# Altium schematic sheet Potencia.SchDoc: GRUPO ALTECH
size A3; DocumentNumber: GA0070; SheetNumber: 4; SheetTotal: 4
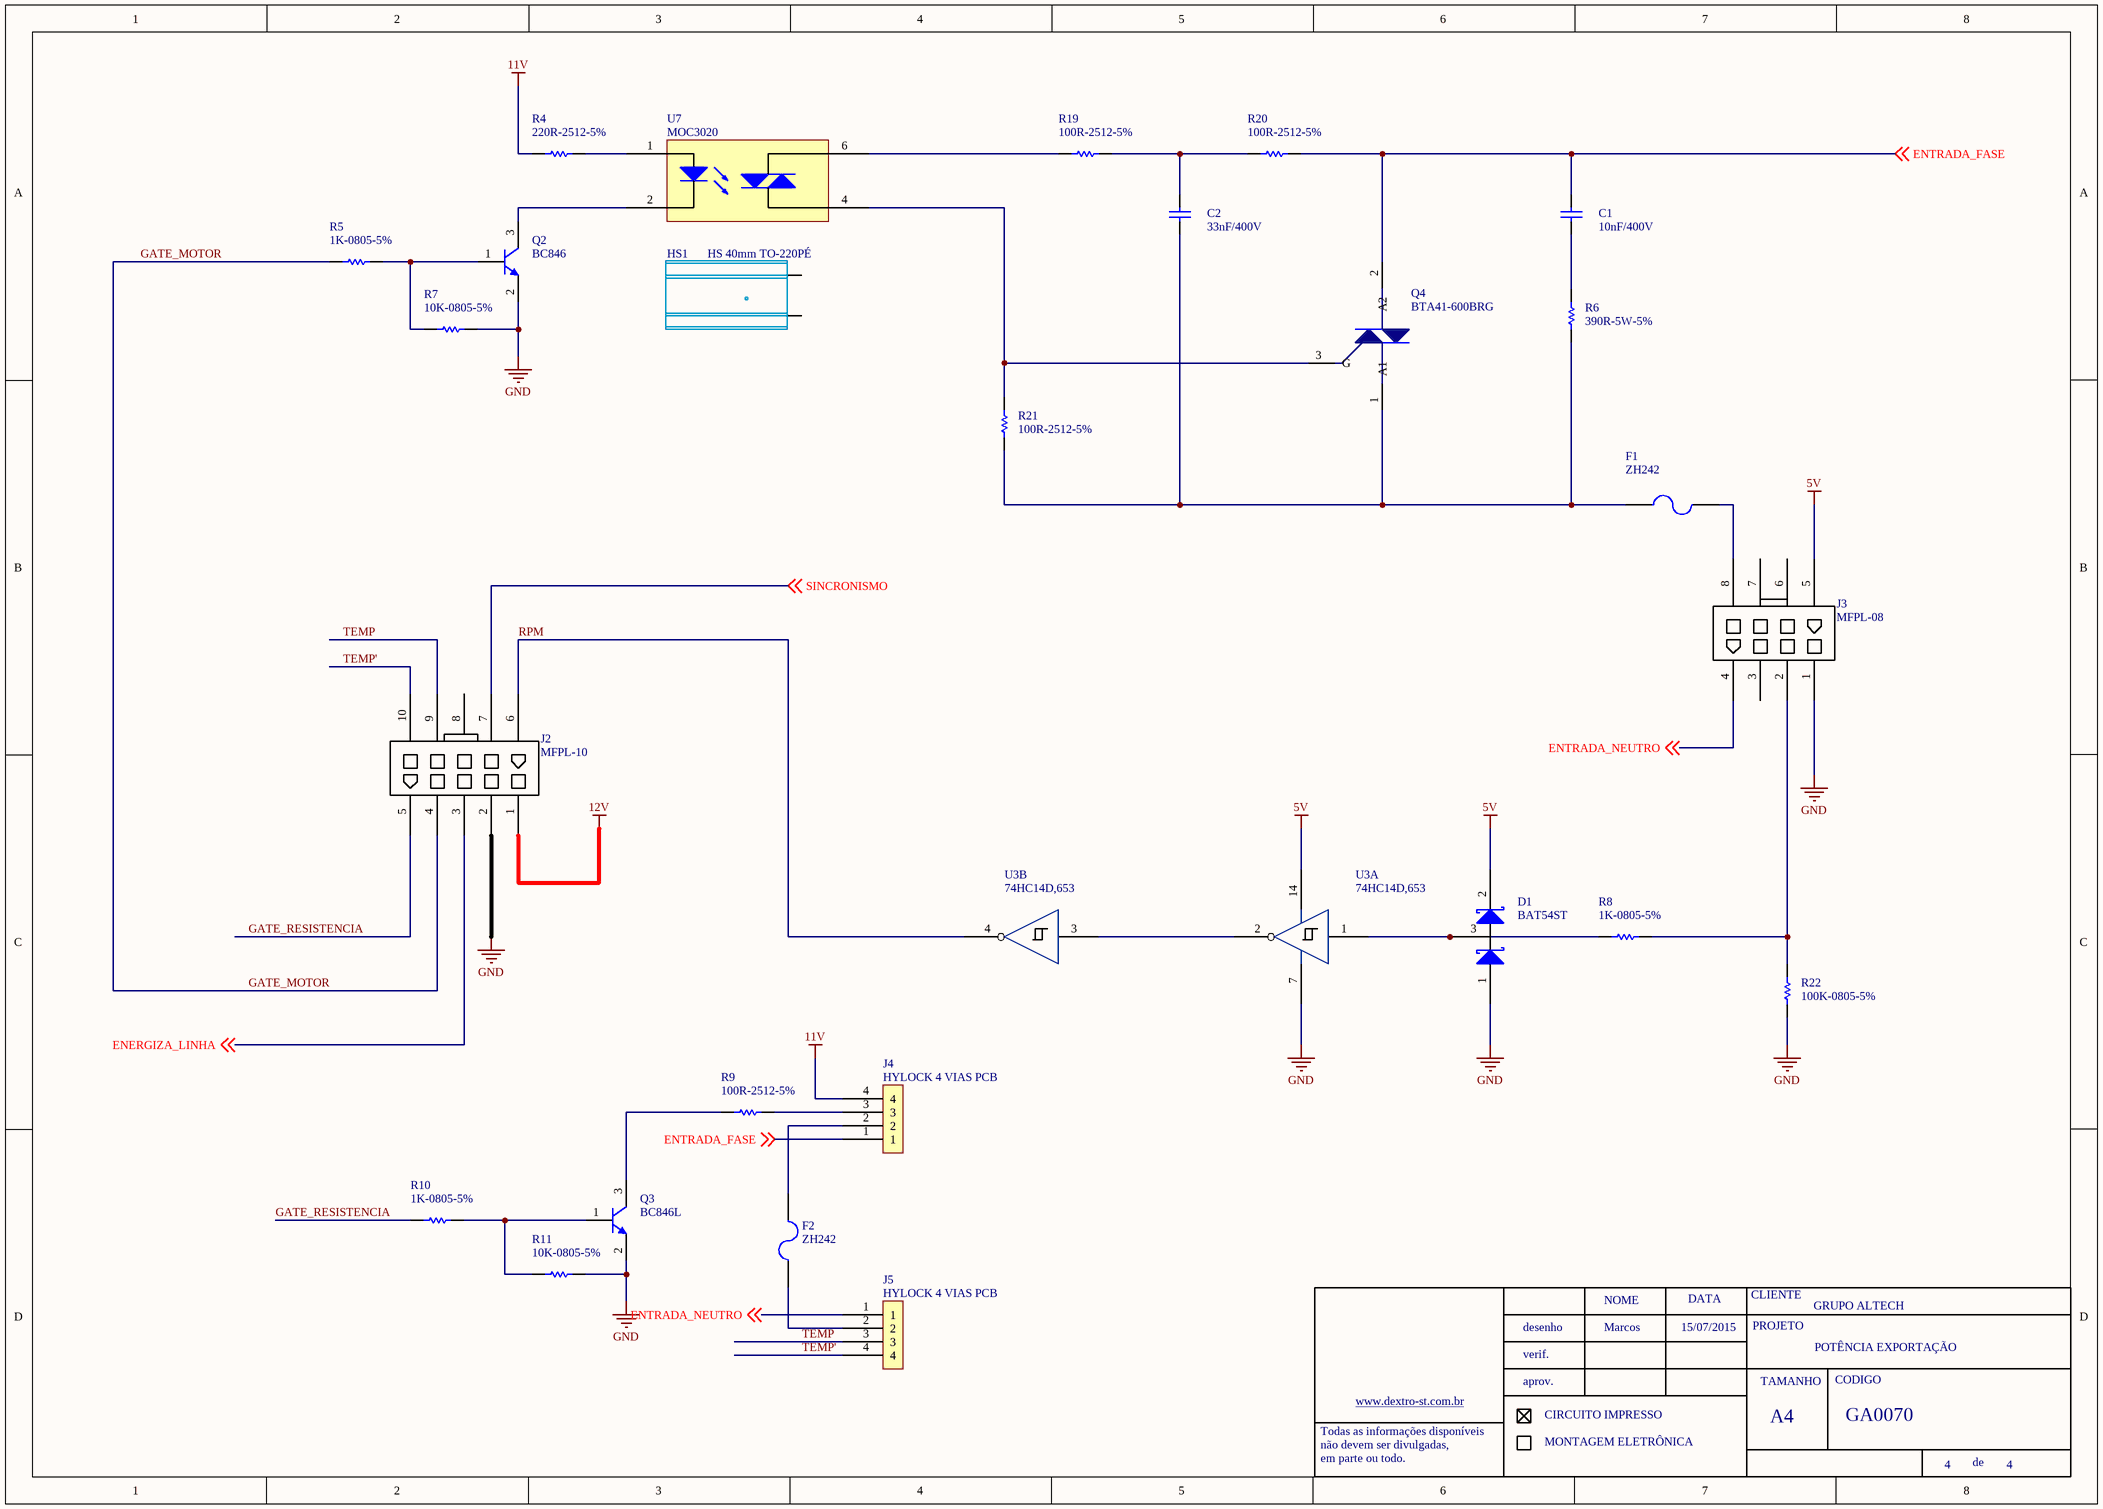
[diagram p0: Potencia.SchDoc]

## Parts
C1  10nF/400V  [cap 330nF/250V]
C2  33nF/400V  [cap 330nF/250V]
D1  BAT54ST  [SOT23 - REVISADO ONDA]
F1  ZH242  [ZH242_REVISADO]
F2  ZH242  [ZH242_REVISADO]
HS1  HS 40mm TO-220PÉ  [dissipador grande]
J2  MFPL-10  [MFPC-10]
J3  MFPL-08  [MFPC-08]
J4  HYLOCK 4 VIAS PCB  [CONECTOR HYLOK 4 VIAS]
J5  HYLOCK 4 VIAS PCB  [CONECTOR HYLOK 4 VIAS]
Q2  BC846  [SOT23 - REVISADO ONDA]
Q3  BC846L
Q4  BTA41-600BRG  [TO-247 - duplicate]
R4  220R-2512-5%  [2512 - REVISADO ONDA]
R5  1K-0805-5%  [0805-REVISADO ONDA]
R6  390R-5W-5%  [RESISTOR 5W FIO]
R7  10K-0805-5%  [0805-REVISADO ONDA]
R8  1K-0805-5%  [0805-REVISADO ONDA]
R9  100R-2512-5%  [2512 - REVISADO ONDA]
R10  1K-0805-5%  [0805-REVISADO ONDA]
R11  10K-0805-5%  [0805-REVISADO ONDA]
R19  100R-2512-5%  [2512 - REVISADO ONDA]
R20  100R-2512-5%  [2512 - REVISADO ONDA]
R21  100R-2512-5%  [2512 - REVISADO ONDA]
R22  100K-0805-5%  [0805-REVISADO ONDA]
U3  74HC14D,653  [SOIC 14 PINOS]  (parts A,B of 6)
U7  MOC3020  [dip6]

## Nets
5V: D1.2 J3.5 U3.14(VCC)
11V: J4.4 R4.2
12V: J2.1
GND: D1.1 J2.2 J3.1 Q2.2(E) Q3.2(E) R7.2 R11.2 R22.1 U3.7(GND)
ENERGIZA_LINHA: J2.3 ; off-sheet ENERGIZA_LINHA
ENTRADA_FASE: C1.2 J4.1 Q4.2(A2) R20.2 ; off-sheet ENTRADA_FASE
ENTRADA_NEUTRO: J3.4 J5.1 ; off-sheet ENTRADA_NEUTRO
GATE_MOTOR: J2.4 R5.1
GATE_RESISTENCIA: J2.5 R10.1
RPM: J2.6 U3.4
SINCRONISMO: J2.7 ; off-sheet SINCRONISMO
TEMP: J2.9 J5.3
TEMP': J2.10 J5.4
NetC1_1: C1.1 R6.1
NetC2_1: C2.1 F1.2 Q4.1(A1) R6.2 R21.1
NetC2_2: C2.2 R19.2 R20.1
NetD1_3: D1.3 R8.1 U3.1
NetF1_1: F1.1 J3.8
NetF2_1: F2.1 J4.2
NetF2_2: F2.2 J5.2
NetJ3_2: J3.2 R8.2 R22.2
NetJ4_3: J4.3 R9.2
NetQ2_1: Q2.1(B) R5.2 R7.1
NetQ2_3: Q2.3(C) U7.2
NetQ3_1: Q3.1(B) R10.2 R11.1
NetQ3_3: Q3.3(C) R9.1
NetQ4_3: Q4.3(G) R21.2 U7.4
NetR4_1: R4.1 U7.1
NetR19_1: R19.1 U7.6
NetU3_2: U3.2 U3.3

Not connected (* = marked no-connect by the designer): HS1 0 1; J2 8; J3 3 6 7

## Notes on the sheet
- Marcos
- 15/07/2015
- POTÊNCIA EXPORTAÇÃO
- NOME
- DATA
- CLIENTE
- PROJETO
- desenho
- verif.
- aprov.
- TAMANHO
- CODIGO
- Todas as informações disponíveis
- não devem ser divulgadas,
- em parte ou todo.
- www.dextro-st.com.br
- CIRCUITO IMPRESSO
- MONTAGEM ELETRÔNICA
- A4
- de

## Library data of the parts
C1 C2 = 100nF/50-0805-NPO: ERP: 104.11.005
F1 F2 = PORTA FUSÍVEL TIPO BERÇO: ERP: 426.00.002
HS1 = DISSIPADOR 40mm PÉ
J4 J5 = PCMC2-4
Q2 = BC846: BC846L; ERP: 106.22.001
Q3 = BC846: ERP: 106.22.001
R5 = 10K-0805-5%: ERP: 102.11.054
R6 = 47R-5W-5%: ERP: 103.16.005
R9 = 100R-0805-5%: ERP: 102.11.031
R19-R21 = 220R-2512-5%: ERP: 102.31.000
U3 = 74HC14D
R4 = 220R-2512-5%: ERP: 102.31.000
R7 R11 = 10K-0805-5%: ERP: 102.11.054
R8 R10 = 1K-0805-5%: ERP: 102.11.042
R22 = 100K-0805-5%: ERP: 102.11.066